# Altium schematic sheet amigaDIP40_2025-07-20.schdoc
size 438 x 277 mm
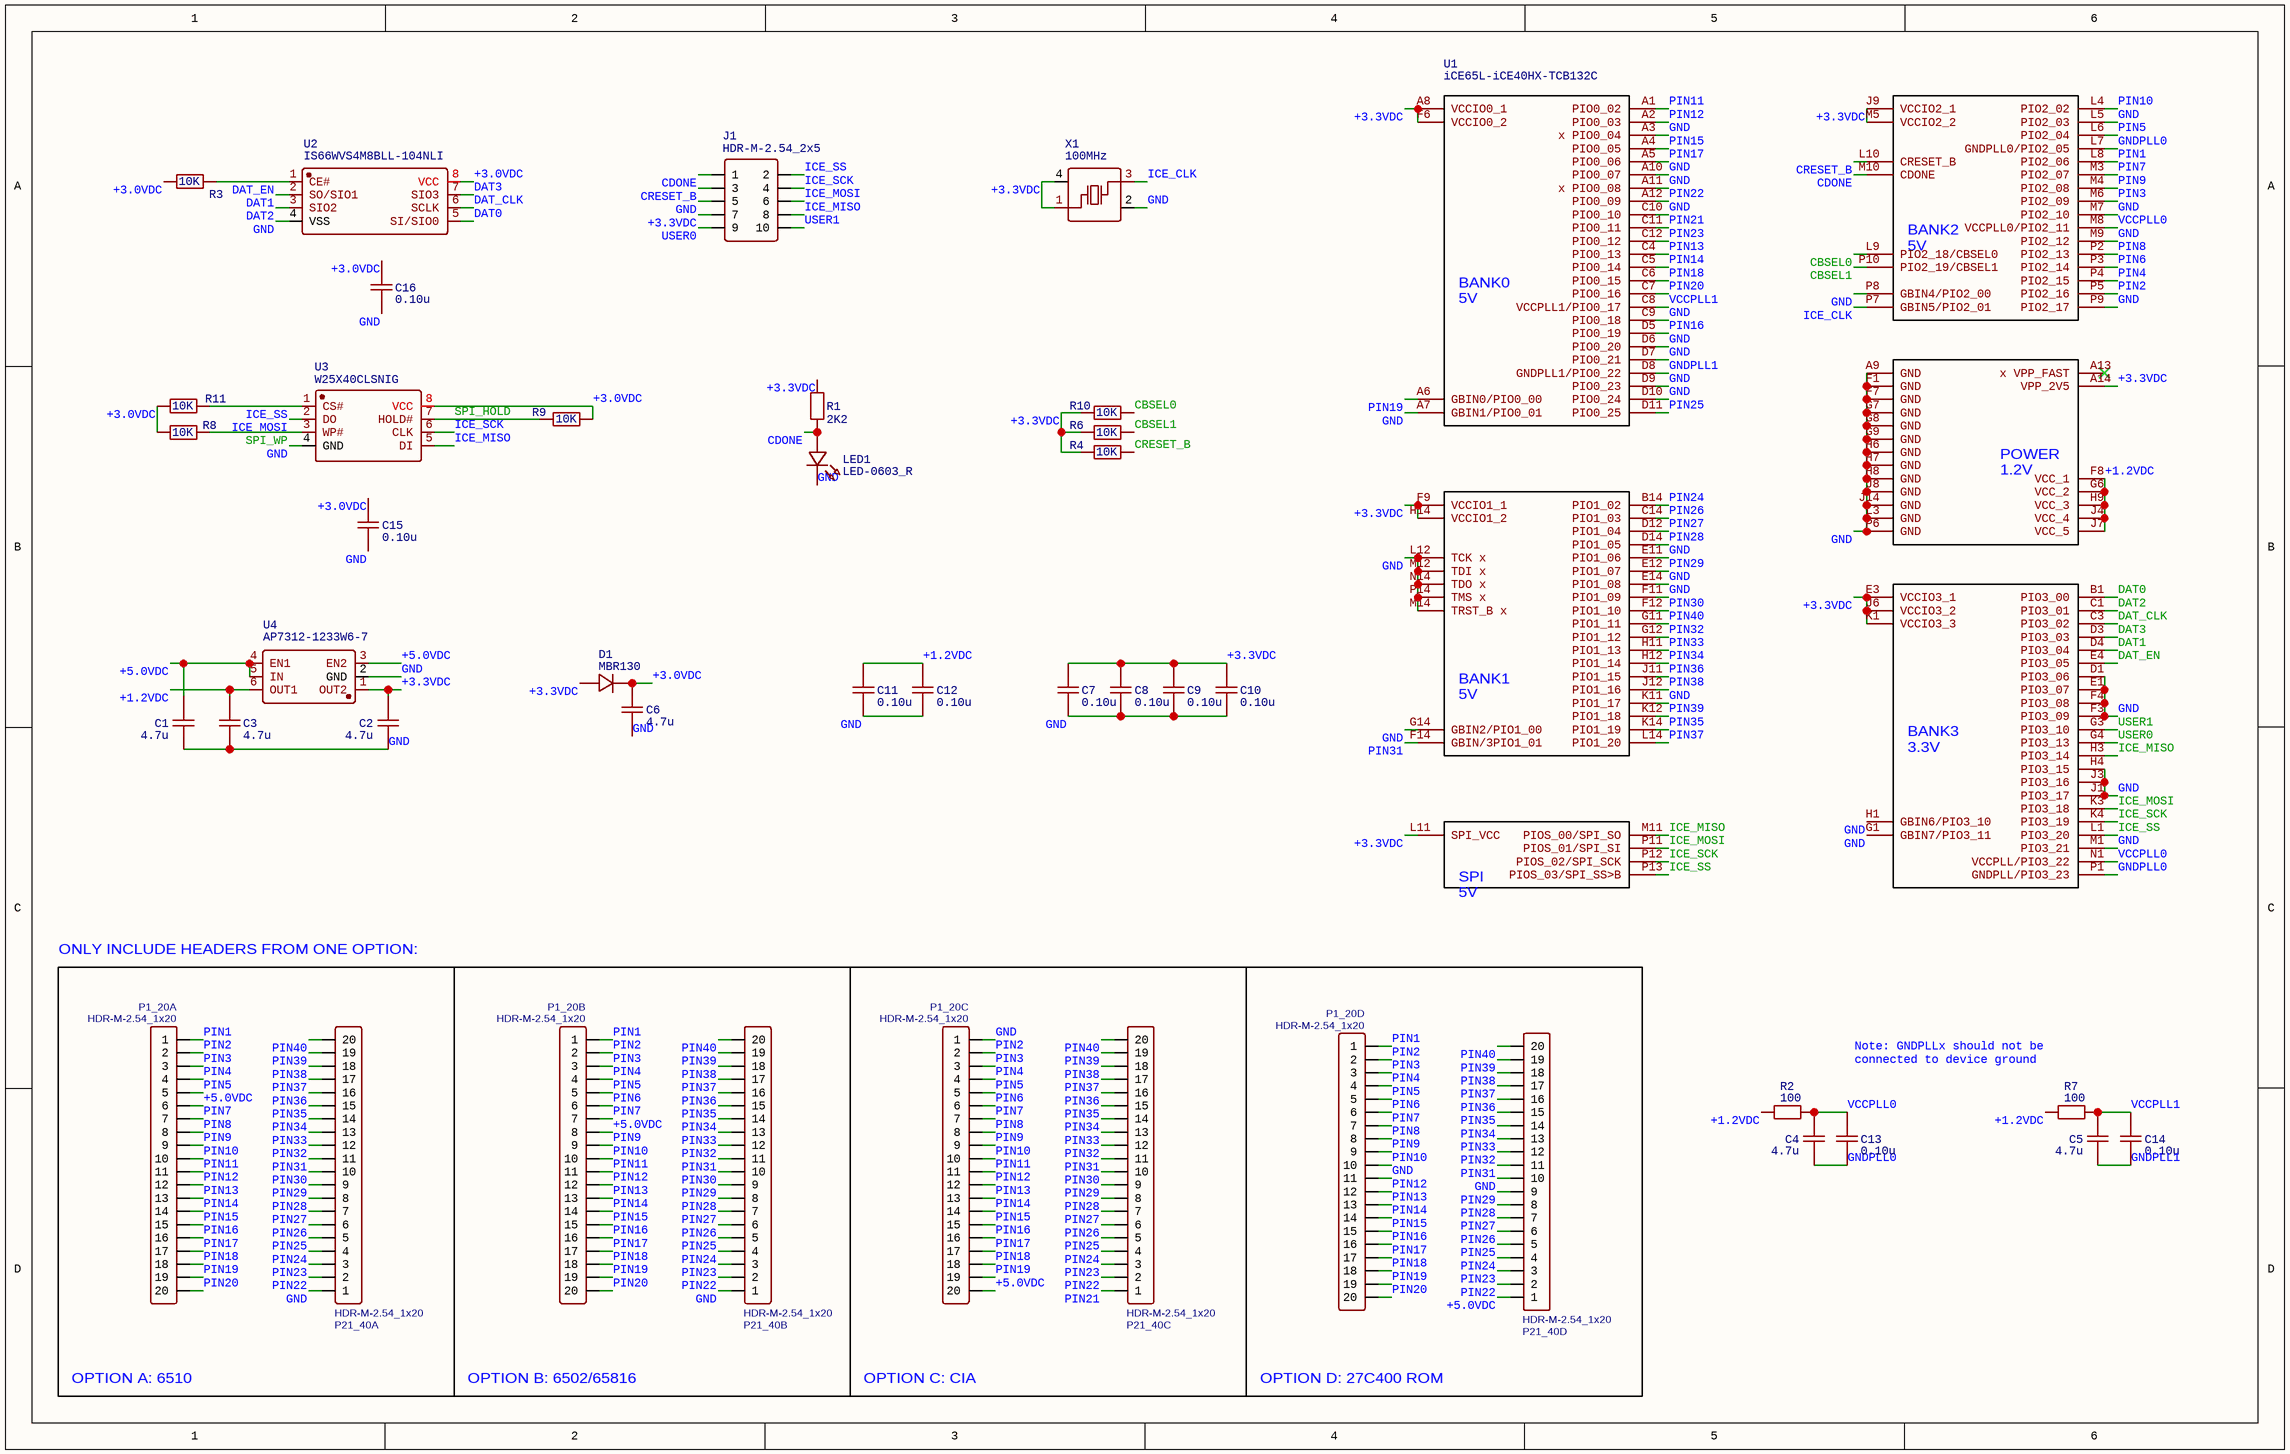
[diagram p0: amigaDIP40_2025-07-20.schdoc]

## Parts
C1  4.7u  [C0603]
C2  4.7u  [C0603]
C3  4.7u  [C0603]
C4  4.7u  [C0603]
C5  4.7u  [C0603]
C6  4.7u  [C0603]
C7  0.10u  [C0402]
C8  0.10u  [C0402]
C9  0.10u  [C0402]
C10  0.10u  [C0402]
C11  0.10u  [C0402]
C12  0.10u  [C0402]
C13  0.10u  [C0402]
C14  0.10u  [C0402]
C15  0.10u  [C0402]
C16  0.10u  [C0402]
D1  MBR130  [SOD-123_L2.8-W1.8-LS3.7-RD]
J1  HDR-M-2.54_2x5  [ICE_PROG]
LED1  LED-0603_R  [LED0603_RED]
P1_20A  HDR-M-2.54_1x20  [HDR-M-2.54_1X20]
P1_20B  HDR-M-2.54_1x20  [HDR-M-2.54_1X20]
P1_20C  HDR-M-2.54_1x20  [HDR-M-2.54_1X20]
P1_20D  HDR-M-2.54_1x20  [HDR-M-2.54_1X20]
P21_40A  HDR-M-2.54_1x20  [HDR-M-2.54_1X20]
P21_40B  HDR-M-2.54_1x20  [HDR-M-2.54_1X20]
P21_40C  HDR-M-2.54_1x20  [HDR-M-2.54_1X20]
P21_40D  HDR-M-2.54_1x20  [HDR-M-2.54_1X20]
R1  2K2  [R0402]
R2  100  [R0402]
R3  10K  [R0402]
R4  10K  [R0402]
R6  10K  [R0402]
R7  100  [R0402]
R8  10K  [R0402]
R9  10K  [R0402]
R10  10K  [R0402]
R11  10K  [R0402]
U1  iCE65L-iCE40HX-TCB132C  [LATC-CSBGA-132]
U2  IS66WVS4M8BLL-104NLI  [SOIC-8_L4.9-W3.9-P1.27-LS6.1-BL]
U3  W25X40CLSNIG  [SOIC-8_L5.0-W4.0-P1.27-LS6.0-BL]
U4  AP7312-1233W6-7  [SOT-26_L3.0-W1.6-P0.95-LS2.8-BR]
X1  100MHz  [OSC-SMD_4P-L3.2-W2.5-BL]

## Blocks framed on the sheet
OPTION B: 6502/65816: P1_20B P21_40B
OPTION C: CIA: P1_20C P21_40C
OPTION D: 27C400 ROM: P1_20D P21_40D

## Nets
+1.2VDC: C3.2 C11.2 C12.2 R2.1 R7.1 U1.F8(VCC_1) U1.G6(VCC_2) U1.H9(VCC_3) U1.J4(VCC_4) U1.J7(VCC_5) U4.6(OUT1)
+3.0VDC: C6.2 C15.2 C16.2 D1.1(C) R3.1 R8.1 R9.1 R11.1 U2.8(VCC) U3.8(VCC)
+3.3VDC: C2.2 C7.2 C8.2 C9.2 C10.2 D1.2(A) J1.7 R1.2 R4.1 R6.1 R10.1 U1.A8(VCCIO0_1) U1.A14(VPP_2V5) U1.E3(VCCIO3_1) U1.F6(VCCIO0_2) U1.F9(VCCIO1_1) U1.H14(VCCIO1_2) U1.J6(VCCIO3_2) U1.J9(VCCIO2_1) U1.K1(VCCIO3_3) U1.L11(SPI_VCC) U1.M5(VCCIO2_2) U4.1(OUT2) X1.1(OSC1) X1.4(GND)
+5.0VDC: C1.2 P1_20A.6 P1_20B.8 P1_20C.20 P21_40D.1 U4.3(EN2) U4.4(EN1) U4.5(IN)
CBSEL0: R10.2 U1.L9(PIO2_18/CBSEL0)
CBSEL1: R6.2 U1.P10(PIO2_19/CBSEL1)
CDONE: J1.1 LED1.1 R1.1 U1.M10(CDONE)
CRESET_B: J1.3 R4.2 U1.L10(CRESET_B)
DAT0: U1.B1(PIO3_00) U2.5(SI/SIO0)
DAT1: U1.D4(PIO3_04) U2.2(SO/SIO1)
DAT2: U1.C1(PIO3_01) U2.3(SIO2)
DAT3: U1.D3(PIO3_03) U2.7(SIO3)
DAT_CLK: U1.C3(PIO3_02) U2.6(SCLK)
DAT_EN: R3.2 U1.E4(PIO3_05) U2.1(CE#)
GND: C1.1 C2.1 C3.1 C6.1 C7.1 C8.1 C9.1 C10.1 C11.1 C12.1 C15.1 C16.1 J1.5 LED1.2 P1_20C.1 P1_20D.11 P21_40A.1 P21_40B.1 P21_40D.10 U1.A3(x_PIO0_04) U1.A7(GBIN1/PIO0_01) U1.A9(GND) U1.A10(PIO0_07) U1.A11(x_PIO0_08) U1.C9(PIO0_18) U1.C10(PIO0_10) U1.D1(PIO3_06) U1.D6(PIO0_20) U1.D7(PIO0_21) U1.D9(PIO0_23) U1.D10(PIO0_24) U1.E1(PIO3_07) U1.E11(PIO1_06) U1.E14(PIO1_08) U1.F1(GND) U1.F3(PIO3_09) U1.F4(PIO3_08) U1.F7(GND) U1.F11(PIO1_09) U1.G1(GBIN7/PIO3_11) U1.G7(GND) U1.G8(GND) U1.G9(GND) U1.G14(GBIN2/PIO1_00) U1.H1(GBIN6/PIO3_10) U1.H4(PIO3_15) U1.H6(GND) U1.H7(GND) U1.H8(GND) U1.J1(PIO3_17) U1.J3(PIO3_16) U1.J8(GND) U1.J14(GND) U1.K11(PIO1_17) U1.L3(GND) U1.L5(PIO2_03) U1.L12(TCK_x) U1.M1(PIO3_21) U1.M7(PIO2_10) U1.M9(PIO2_12) U1.M12(TDI_x) U1.M14(TRST_B_x) U1.N14(TDO_x) U1.P6(GND) U1.P8(GBIN4/PIO2_00) U1.P9(PIO2_17) U1.P14(TMS_x) U2.4(VSS) U3.4(GND) U4.2(GND) X1.2(GND)
GNDPLL0: C4.1 C13.1 U1.L7(GNDPLL0/PIO2_05) U1.P1(GNDPLL/PIO3_23)
GNDPLL1: C5.1 C14.1 U1.D8(GNDPLL1/PIO0_22)
ICE_CLK: U1.P7(GBIN5/PIO2_01) X1.3(OSC2)
ICE_MISO: J1.8 U1.H3(PIO3_14) U1.M11(PIOS_00/SPI_SO) U3.5(DI)
ICE_MOSI: J1.6 U1.K3(PIO3_18) U1.P11(PIOS_01/SPI_SI) U3.2(DO)
ICE_SCK: J1.4 U1.K4(PIO3_19) U1.P12(PIOS_02/SPI_SCK) U3.6(CLK)
ICE_SS: J1.2 R11.2 U1.L1(PIO3_20) U1.P13(PIOS_03/SPI_SS>B) U3.1(CS#)
PIN1: P1_20A.1 P1_20B.1 P1_20D.1 U1.L8(PIO2_06)
PIN2: P1_20A.2 P1_20B.2 P1_20C.2 P1_20D.2 U1.P5(PIO2_16)
PIN3: P1_20A.3 P1_20B.3 P1_20C.3 P1_20D.3 U1.M6(PIO2_09)
PIN4: P1_20A.4 P1_20B.4 P1_20C.4 P1_20D.4 U1.P4(PIO2_15)
PIN5: P1_20A.5 P1_20B.5 P1_20C.5 P1_20D.5 U1.L6(PIO2_04)
PIN6: P1_20B.6 P1_20C.6 P1_20D.6 U1.P3(PIO2_14)
PIN7: P1_20A.7 P1_20B.7 P1_20C.7 P1_20D.7 U1.M3(PIO2_07)
PIN8: P1_20A.8 P1_20C.8 P1_20D.8 U1.P2(PIO2_13)
PIN9: P1_20A.9 P1_20B.9 P1_20C.9 P1_20D.9 U1.M4(PIO2_08)
PIN10: P1_20A.10 P1_20B.10 P1_20C.10 P1_20D.10 U1.L4(PIO2_02)
PIN11: P1_20A.11 P1_20B.11 P1_20C.11 U1.A1(PIO0_02)
PIN12: P1_20A.12 P1_20B.12 P1_20C.12 P1_20D.12 U1.A2(PIO0_03)
PIN13: P1_20A.13 P1_20B.13 P1_20C.13 P1_20D.13 U1.C4(PIO0_13)
PIN14: P1_20A.14 P1_20B.14 P1_20C.14 P1_20D.14 U1.C5(PIO0_14)
PIN15: P1_20A.15 P1_20B.15 P1_20C.15 P1_20D.15 U1.A4(PIO0_05)
PIN16: P1_20A.16 P1_20B.16 P1_20C.16 P1_20D.16 U1.D5(PIO0_19)
PIN17: P1_20A.17 P1_20B.17 P1_20C.17 P1_20D.17 U1.A5(PIO0_06)
PIN18: P1_20A.18 P1_20B.18 P1_20C.18 P1_20D.18 U1.C6(PIO0_15)
PIN19: P1_20A.19 P1_20B.19 P1_20C.19 P1_20D.19 U1.A6(GBIN0/PIO0_00)
PIN20: P1_20A.20 P1_20B.20 P1_20D.20 U1.C7(PIO0_16)
PIN21: P21_40C.1 U1.C11(PIO0_11)
PIN22: P21_40A.2 P21_40B.2 P21_40C.2 P21_40D.2 U1.A12(PIO0_09)
PIN23: P21_40A.3 P21_40B.3 P21_40C.3 P21_40D.3 U1.C12(PIO0_12)
PIN24: P21_40A.4 P21_40B.4 P21_40C.4 P21_40D.4 U1.B14(PIO1_02)
PIN25: P21_40A.5 P21_40B.5 P21_40C.5 P21_40D.5 U1.D11(PIO0_25)
PIN26: P21_40A.6 P21_40B.6 P21_40C.6 P21_40D.6 U1.C14(PIO1_03)
PIN27: P21_40A.7 P21_40B.7 P21_40C.7 P21_40D.7 U1.D12(PIO1_04)
PIN28: P21_40A.8 P21_40B.8 P21_40C.8 P21_40D.8 U1.D14(PIO1_05)
PIN29: P21_40A.9 P21_40B.9 P21_40C.9 P21_40D.9 U1.E12(PIO1_07)
PIN30: P21_40A.10 P21_40B.10 P21_40C.10 U1.F12(PIO1_10)
PIN31: P21_40A.11 P21_40B.11 P21_40C.11 P21_40D.11 U1.F14(GBIN/3PIO1_01)
PIN32: P21_40A.12 P21_40B.12 P21_40C.12 P21_40D.12 U1.G12(PIO1_12)
PIN33: P21_40A.13 P21_40B.13 P21_40C.13 P21_40D.13 U1.H11(PIO1_13)
PIN34: P21_40A.14 P21_40B.14 P21_40C.14 P21_40D.14 U1.H12(PIO1_14)
PIN35: P21_40A.15 P21_40B.15 P21_40C.15 P21_40D.15 U1.K14(PIO1_19)
PIN36: P21_40A.16 P21_40B.16 P21_40C.16 P21_40D.16 U1.J11(PIO1_15)
PIN37: P21_40A.17 P21_40B.17 P21_40C.17 P21_40D.17 U1.L14(PIO1_20)
PIN38: P21_40A.18 P21_40B.18 P21_40C.18 P21_40D.18 U1.J12(PIO1_16)
PIN39: P21_40A.19 P21_40B.19 P21_40C.19 P21_40D.19 U1.K12(PIO1_18)
PIN40: P21_40A.20 P21_40B.20 P21_40C.20 P21_40D.20 U1.G11(PIO1_11)
SPI_HOLD: R9.2 U3.7(HOLD#)
SPI_WP: R8.2 U3.3(WP#)
USER0: J1.9 U1.G4(PIO3_13)
USER1: J1.10 U1.G3(PIO3_10)
VCCPLL0: C4.2 C13.2 R2.2 U1.M8(VCCPLL0/PIO2_11) U1.N1(VCCPLL/PIO3_22)
VCCPLL1: C5.2 C14.2 R7.2 U1.C8(VCCPLL1/PIO0_17)

Not connected (* = marked no-connect by the designer): U1 A13(x_VPP_FAST)*

## Notes on the sheet
- ONLY INCLUDE HEADERS FROM ONE OPTION:
- (near C13) Note: GNDPLLx should not be
  connected to device ground
- OPTION A: 6510
- (in symbol iCE65L-iCE40HX-TCB132C) BANK2 / 5V; BANK0 / 5V; POWER / 1.2V; BANK1 / 5V; BANK3 / 3.3V; SPI / 5V

## Library data of the parts
C1-C6 = 4.7u: Manufacturer Part: GCM21BR71E105KA56L; Manufacturer: MuRata; nameAlias: Value(F); Contributor: LCEDA_Lib; Supplier Part: C85865; Supplier: LCSC; spicePre: C; spiceSymbolName: C_0603_US
C7-C16 = 0.10u: Manufacturer Part: GRM188R71H104KA93D; Manufacturer: MuRata; nameAlias: Value(F); Contributor: LCEDA_Lib; Supplier Part: C77055; Supplier: LCSC; spicePre: C; spiceSymbolName: C_0603_US
D1 = MBR130: Manufacturer: SK; Contributor: LCSC; Supplier: LCSC; Manufacturer Part: MBR130; Supplier Part: C126484; JLCPCB Part Class: Extended Part; spicePre: D; spiceSymbolName: MBR130
J1 = HDR-M-2.54_2x5: Contributor: LCEDA_Lib; Supplier Part: C178292; Supplier: LCSC; spicePre: J; spiceSymbolName: HDR-M-2.54_2x5
LED1 = LED-0603_R: Manufacturer: EVERLIGHT(台湾亿光); Manufacturer Part: 19-217/R6C-AL1M2VY/3T; Contributor: LCEDA_01; Supplier Part: C72044; Supplier: LCSC; spicePre: L; spiceSymbolName: LED-0603_R
P1_20A P1_20B P1_20C P1_20D P21_40A P21_40B P21_40C P21_40D = HDR-M-2.54_1x20: Contributor: LCEDA_Lib; Supplier Part: C50981; Supplier: LCSC; spicePre: J; spiceSymbolName: HDR-M-2.54_1x20
R1 = 2K2: Manufacturer Part: 0402WGF1003TCE; Manufacturer: UniOhm; nameAlias: Value(Ω); Contributor: LCEDA_Lib; Supplier Part: C25741; Supplier: LCSC; spicePre: R; spiceSymbolName: R_0201_EU
R2 R7 = 100: nameAlias: Value(Ω); Contributor: LCEDA_Lib; spicePre: R; spiceSymbolName: R_0201_EU
R3 R4 R6 R8-R11 = 10K: Manufacturer Part: 0402WGF1003TCE; Manufacturer: UniOhm; nameAlias: Value(Ω); Contributor: LCEDA_Lib; Supplier Part: C25741; Supplier: LCSC; spicePre: R; spiceSymbolName: R_0201_EU
U1 = iCE65L-iCE40HX-TCB132C: Manufacturer: Lattice; Manufacturer Part: ICE65L04F-TCB132C; Contributor: Renee; Supplier: Digi-Key; Supplier Part: ICE65L04F-TCB132C-ND; link: https://www.digikey.ca/short/w7qnd7m4; spicePre: U; spiceSymbolName: iCE65L-iCE40HX-TCB132C
U2 = IS66WVS4M8BLL-104NLI: Manufacturer: null; Manufacturer Part: ESP-PSRAM64H; Contributor: LCSC; Supplier: LCSC; Supplier Part: C2763896; JLCPCB Part Class: Extended Part; spicePre: U; spiceSymbolName: ESP-PSRAM64H
U3 = W25X40CLSNIG: Manufacturer: WINBOND; Supplier: LCSC; Manufacturer Part: W25X40CLSNIG; Supplier Part: C19617; JLCPCB Part Class: Extended Part; spicePre: U; spiceSymbolName: W25X40CLSNIG
U4 = AP7312-1233W6-7: Manufacturer: DIODES(美台); Manufacturer Part: AP7312-1828W6-7; Contributor: lcsc; Supplier: LCSC; Supplier Part: C5125494; link: https://atta.szlcsc.com/upload/public/pdf/source/20220805/60E9168373D2E630B0C5B82E73D8D7A9.pdf; spicePre: U; spiceSymbolName: AP7312-1828W6-7
X1 = 100MHz: Manufacturer: TAITIEN Elec; Manufacturer Part: OXETDLJTNF-100.000000MHZ; nameAlias: Frequency; Contributor: LCSC; Supplier: LCSC; Supplier Part: C558770; spicePre: X; spiceSymbolName: SMD-3225_4P12MHZ10PF10PPM-40~+85℃